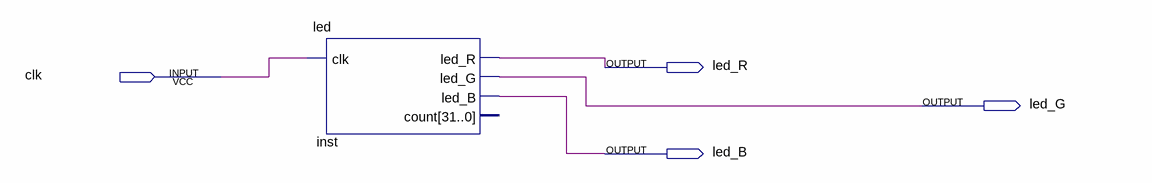
[diagram p0: schematic sheet]
// Quartus schematic b_led.bdf as structural Verilog: 1 symbols, 4 pins
module b_led (
  input  clk,
  output led_R,
  output led_G,
  output led_B
);

  led inst (.clk(clk), .led_R(led_R), .led_G(led_G), .led_B(led_B));  // open: count
endmodule
